# Altium schematic sheet P2_CCD_CAM_BOARD_POWER.SchDoc (part 2 of 3)
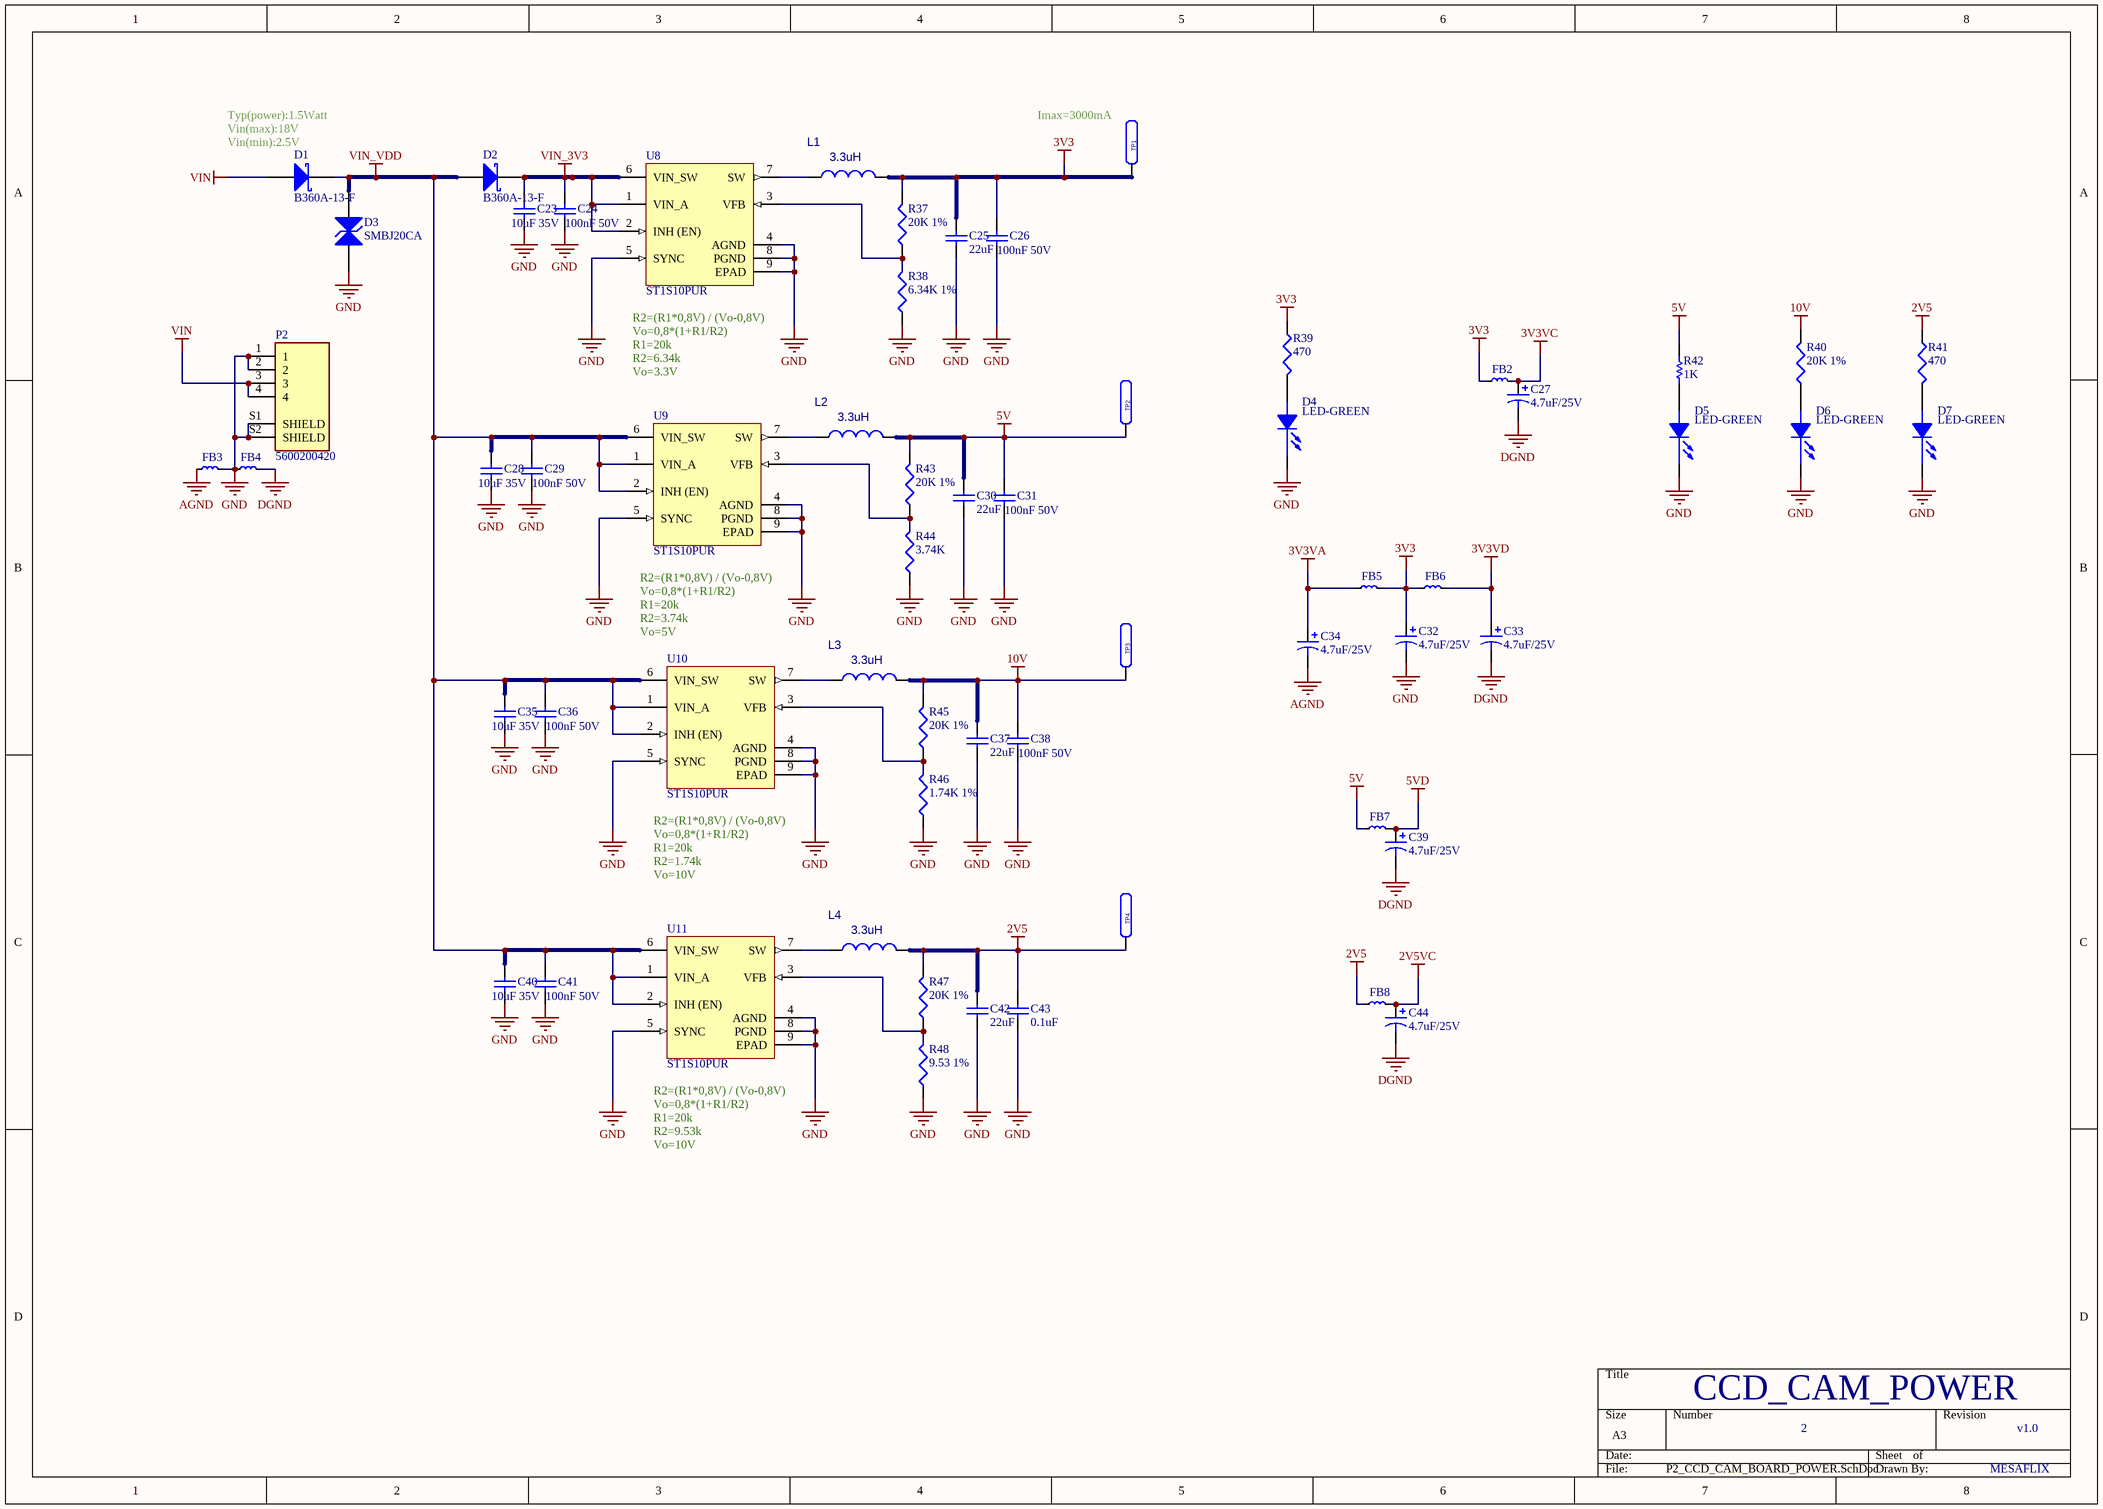
[diagram p1: P2_CCD_CAM_BOARD_POWER.SchDoc]
## Library data of the parts
C23 C28 C35 C40 = Cap: Cap Ceramic 10uF 35V X5R 20% Pad SMD 0603 85C T/R; Manufacturer: Murata; Manufacturer Part Number: GRM188R6YA106MA73D; ComponentLink1URL: http://components.arrow.com/part/dataview/0323_06977919?src-supplier=Arrow+Europe; ComponentLink1Description: http://components.arrow.com/part/dataview/0323_06977919?src-supplier=Arrow+Europe; ComponentLink2URL: http://www.farnell.com/datasheets/1955679.pdf?src-supplier=Farnell; ComponentLink2Description: http://www.farnell.com/datasheets/1955679.pdf?src-supplier=Farnell; ComponentLink3URL: http://www.mouser.com/ds/2/281/c02e-2905.pdf?src-supplier=Mouser; ComponentLink3Description: http://www.mouser.com/ds/2/281/c02e-2905.pdf?src-supplier=Mouser; ComponentLink4URL: http://search.murata.co.jp/Ceramy/image/img/A01X/G101/ENG/GRM188R60J106KE47-02.pdf?src-supplier=Digi-Key; ComponentLink4Description: http://search.murata.co.jp/Ceramy/image/img/A01X/G101/ENG/GRM188R60J106KE47-02.pdf?src-supplier=Digi-Key; ComponentLink5URL: http://www.farnell.com/datasheets/1955679.pdf?src-supplier=Newark; ComponentLink5Description: http://www.farnell.com/datasheets/1955679.pdf?src-supplier=Newark; ComponentLink6URL: http://www.farnell.com/datasheets/1955679.pdf?src-supplier=Element14; ComponentLink6Description: http://www.farnell.com/datasheets/1955679.pdf?src-supplier=Element14; ComponentLink7URL: http://psearch.en.murata.com/capacitor/product/GRM188R60J106KE47%23.pdf?src-supplier=Avnet; ComponentLink7Description: http://psearch.en.murata.com/capacitor/product/GRM188R60J106KE47%23.pdf?src-supplier=Avnet; Supplier 1: Digi-Key; Supplier Part Number 1: 490-13248-1-ND; RoHS: Yes; Category: Ceramic Capacitors; Stock 1: 69307; Pricing 1: 1=0,50000, 10=0,34600, 100=0,20760, 500=0,15570, 1000=0,13148 (USD); Mount: Surface Mount; Case/Package: 0603; Case Code (Metric): 1608; Case Code (Imperial): 0603; Min Operating Temperature: -55°C; Max Operating Temperature: 85°C; Packaging: Tape and Reel; Capacitance: 10uF; Voltage Rating: 35V; Tolerance: 20%; Voltage Rating (DC): 35V; Dielectric: X5R; Length: 0.063inch; Width: 0.031inch; Thickness: 0.039inch; ComponentLink8URL: http://search.murata.co.jp/Ceramy/image/img/A01X/G101/ENG/GRM188R6YA106MA73-01.pdf?src-supplier=Digi-Key; ComponentLink8Description: http://search.murata.co.jp/Ceramy/image/img/A01X/G101/ENG/GRM188R6YA106MA73-01.pdf?src-supplier=Digi-Key; ComponentLink9URL: http://search.murata.co.jp/Ceramy/image/img/A01X/G101/ENG/GRM188R6YA106MA73-01.pdf?src-supplier=Mouser; ComponentLink9Description: http://search.murata.co.jp/Ceramy/image/img/A01X/G101/ENG/GRM188R6YA106MA73-01.pdf?src-supplier=Mouser; ComponentLink10URL: https://www.murata.com/~/media/webrenewal/support/library/catalog/products/capacitor/mlcc/c02e.ashx?la=en-us&src-supplier=Digi-Key; ComponentLink10Description: https://www.murata.com/~/media/webrenewal/support/library/catalog/products/capacitor/mlcc/c02e.ashx?la=en-us&src-supplier=Digi-Key; ComponentLink11URL: http://search.murata.co.jp/Ceramy/image/img/A01X/G101/ENG/GRM188R6YA106MA73-01.pdf?src-supplier=Future+Electronics; ComponentLink11Description: http://search.murata.co.jp/Ceramy/image/img/A01X/G101/ENG/GRM188R6YA106MA73-01.pdf?src-supplier=Future+Electronics; ComponentLink12URL: http://search.murata.co.jp/Ceramy/image/img/A01X/G101/ENG/GRM188R6YA106MA73-01.pdf?src-supplier=TTI; ComponentLink12Description: http://search.murata.co.jp/Ceramy/image/img/A01X/G101/ENG/GRM188R6YA106MA73-01.pdf?src-supplier=TTI
C24 C26 C29 C31 C36 C38 C41 = CAP0603_100nF: CAP CER 0.1UF 50V X7R 0603; P/N: C0603C104K5RACTU; Order Code: DIGI : 399-5089-1-ND; Value: 100nF 50V
C25 C30 C37 C42 = Cap: MURATA - GRM188R60J226MEA0D - CAP, 22µF, 6.3V, 20%, X5R, 0603; ComponentLink1URL: http://components.arrow.com/part/dataview/0323_06977919?src-supplier=Arrow+Europe; ComponentLink1Description: http://components.arrow.com/part/dataview/0323_06977919?src-supplier=Arrow+Europe; ComponentLink2URL: http://www.farnell.com/datasheets/1955679.pdf?src-supplier=Farnell; ComponentLink2Description: http://www.farnell.com/datasheets/1955679.pdf?src-supplier=Farnell; ComponentLink3URL: http://www.mouser.com/ds/2/281/c02e-2905.pdf?src-supplier=Mouser; ComponentLink3Description: http://www.mouser.com/ds/2/281/c02e-2905.pdf?src-supplier=Mouser; ComponentLink4URL: http://search.murata.co.jp/Ceramy/image/img/A01X/G101/ENG/GRM188R60J106KE47-02.pdf?src-supplier=Digi-Key; ComponentLink4Description: http://search.murata.co.jp/Ceramy/image/img/A01X/G101/ENG/GRM188R60J106KE47-02.pdf?src-supplier=Digi-Key; ComponentLink5URL: http://www.farnell.com/datasheets/1955679.pdf?src-supplier=Newark; ComponentLink5Description: http://www.farnell.com/datasheets/1955679.pdf?src-supplier=Newark; ComponentLink6URL: http://www.farnell.com/datasheets/1955679.pdf?src-supplier=Element14; ComponentLink6Description: http://www.farnell.com/datasheets/1955679.pdf?src-supplier=Element14; ComponentLink7URL: http://psearch.en.murata.com/capacitor/product/GRM188R60J106KE47%23.pdf?src-supplier=Avnet; ComponentLink7Description: http://psearch.en.murata.com/capacitor/product/GRM188R60J106KE47%23.pdf?src-supplier=Avnet; Supplier 1: Digi-Key; Supplier Part Number 1: 490-7611-1-ND; Manufacturer: Murata; Manufacturer Part Number: GRM188R60J226MEA0D; RoHS: Yes; Category: Ceramic Capacitors; Stock 1: 5425522; Pricing 1: 1=0,26000, 10=0,17600, 100=0,10000, 500=0,07058, 1000=0,06176 (USD); Mount: Surface Mount; Case/Package: 0603; Weight: 0.000222oz; Case Code (Metric): 1608; Case Code (Imperial): 0603; Min Operating Temperature: -55°C; Max Operating Temperature: 85°C; Capacitance: 22uF; Tolerance: 20%; Packaging: Tape and Reel; Package Quantity: 4000; Voltage Rating: 6.3V; Dielectric: X5R; Termination: SMD/SMT; Voltage Rating (DC): 6.3V; Length: 1.6mm; Height: 0.8mm; Width: 0.8mm; Thickness: 0.039inch; Depth: 0.8mm; REACH SVHC: No SVHC; Lead Free: Lead Free; ComponentLink8URL: https://datasheet.ciiva.com/29540/partnumbering-e-01-29540441.pdf?src-supplier=Digi-Key; ComponentLink8Description: https://datasheet.ciiva.com/29540/partnumbering-e-01-29540441.pdf?src-supplier=Digi-Key; ComponentLink9URL: https://datasheet.ciiva.com/29540/partnumbering-e-01-29540442.pdf?src-supplier=Digi-Key; ComponentLink9Description: https://datasheet.ciiva.com/29540/partnumbering-e-01-29540442.pdf?src-supplier=Digi-Key; ComponentLink10URL: https://datasheet.ciiva.com/29540/partnumbering-e-01-29540443.pdf?src-supplier=Digi-Key; ComponentLink10Description: https://datasheet.ciiva.com/29540/partnumbering-e-01-29540443.pdf?src-supplier=Digi-Key
C27 C32-C34 C39 C44 = Cap Chip Pol: GRM219R61E475KA73D / Chip capacitor can be polarized or not, depending on the chip type.  Verify Capacitance and package size before placing.; Mfr Part #: GRM219R61E475KA73D
C43 = Cap: Capacitor; Manufacturer: Murata; Manufacturer Part Number: GRM155R71C104KA88D; Material: Ceramic; Capacitance: 100nF; Tolerance: 10%; Dielectric: X7R; Voltage Rating: 16V; Insulation Resistance: 10GR; Supplier 1: Digi-Key; Supplier Part Number 1: 490-3261-6-ND; Stock 1: 141162259; Pricing 1: 1 = 0,10000, 10 = 0,03300, 100 = 0,01470, 500 = 0,01046, 1000 = 0,00822, 2500 = 0,00748, 5000 = 0,00688 (USD); RoHS: Yes; Mount: Surface Mount; Case/Package: 0402; Number of Pins: 2; Case Code (Metric): 1005; Case Code (Imperial): 0402; Dielectric Material: Ceramic; Min Operating Temperature: -55°C; Max Operating Temperature: 125°C; Packaging: Tape and Reel; Voltage Rating (DC): 16V; Package Quantity: 1; Termination: SMD/SMT; Voltage: 16V; Length: 1mm; Height: 0.5mm; Width: 0.5mm; Thickness: 0.022inch; Depth: 0.5mm; Radiation Hardening: No; REACH SVHC: No SVHC; Lead Free: Lead Free; ComponentLink1URL: https://datasheet.ciiva.com/18102/getdatasheetpartid-85307-18102905.pdf?src-supplier=Verical; ComponentLink1Description: https://datasheet.ciiva.com/18102/getdatasheetpartid-85307-18102905.pdf?src-supplier=Verical; ComponentLink2URL: https://datasheet.ciiva.com/129/grm155r71c104ka88-01-129739.pdf?src-supplier=Digi-Key; ComponentLink2Description: https://datasheet.ciiva.com/129/grm155r71c104ka88-01-129739.pdf?src-supplier=Digi-Key; ComponentLink3URL: https://datasheet.ciiva.com/129/grm155r71c104ka88-01-129740.pdf?src-supplier=Digi-Key; ComponentLink3Description: https://datasheet.ciiva.com/129/grm155r71c104ka88-01-129740.pdf?src-supplier=Digi-Key; ComponentLink4URL: https://datasheet.ciiva.com/29199/454098-da-01-en-vs-kondensator-0402-29199799.pdf?src-supplier=Conrad; ComponentLink4Description: https://datasheet.ciiva.com/29199/454098-da-01-en-vs-kondensator-0402-29199799.pdf?src-supplier=Conrad; ComponentLink5URL: https://datasheet.ciiva.com/28534/4360-28534133.pdf?src-supplier=Element14; ComponentLink5Description: https://datasheet.ciiva.com/28534/4360-28534133.pdf?src-supplier=Element14; ComponentLink6URL: https://datasheet.ciiva.com/14103/grmseries-highdielectrictype-eng-14103750.pdf?src-supplier=Distrelec; ComponentLink6Description: https://datasheet.ciiva.com/14103/grmseries-highdielectrictype-eng-14103750.pdf?src-supplier=Distrelec; ComponentLink7URL: https://datasheet.ciiva.com/16199/product-16199000.pdf?src-supplier=Future+Electronics; ComponentLink7Description: https://datasheet.ciiva.com/16199/product-16199000.pdf?src-supplier=Future+Electronics; ComponentLink8URL: https://datasheet.ciiva.com/14116/grmseries-highdielectrictype-eng-14116878.pdf?src-supplier=Distrelec; ComponentLink8Description: https://datasheet.ciiva.com/14116/grmseries-highdielectrictype-eng-14116878.pdf?src-supplier=Distrelec; ComponentLink9URL: https://datasheet.ciiva.com/7937/4360-7937615.pdf?src-supplier=Element14; ComponentLink9Description: https://datasheet.ciiva.com/7937/4360-7937615.pdf?src-supplier=Element14; ComponentLink10URL: https://datasheet.ciiva.com/28534/4360-28534127.pdf?src-supplier=Element14; ComponentLink10Description: https://datasheet.ciiva.com/28534/4360-28534127.pdf?src-supplier=Element14
D1 D2 = CMP-2000-05898-1: Schottky Barrier Rectifier, 3 A, -55 to 150 degC, 2-Pin Molded, RoHS, Tape and Reel; Manufacturer: Diodes; Forward Current: 3A; Max Repetitive Reverse Voltage (Vrrm): 60V; Element Configuration: Single; Forward Voltage: 700mV; Peak Reverse Current: 500uA; Max Forward Surge Current (Ifsm): 80A; Polarity: Standard; Capacitance: 250pF; Supplier 1: Digi-Key; Supplier Part Number 1: B360A-FDICT-ND; Manufacturer Part Number: B360A-13-F; RoHS: Yes; Category: Schottky Diodes; Stock 1: 508300; Pricing 1: 1=0,38000, 10=0,30800, 100=0,17690, 500=0,16380, 1000=0,11138 (USD); Mount: Surface Mount; Case/Package: SMA; Number of Pins: 2; Weight: 0.002258oz; Contact Plating: Tin,Matte; Min Operating Temperature: -55°C; Max Operating Temperature: 150°C; Packaging: Tape and Reel; Peak Non-Repetitive Surge Current: 80A; Package Quantity: 5000; Average Rectified Current: 3A; Termination: SMD/SMT; Voltage Rating (DC): 60V; Current Rating: 3A; Output Current: 3A; Max Reverse Voltage (DC): 60V; Length: 4.6mm; Height: 2.3mm; Width: 2.92mm; Radiation Hardening: No; REACH SVHC: No SVHC; Lead Free: Lead Free; ComponentLink1URL: https://datasheet.ciiva.com/914/ds30891-914080.pdf?src-supplier=Digi-Key; ComponentLink1Description: https://datasheet.ciiva.com/914/ds30891-914080.pdf?src-supplier=Digi-Key; ComponentLink2URL: https://datasheet.ciiva.com/4244/861ds30891-4244631.pdf?src-supplier=Arrow; ComponentLink2Description: https://datasheet.ciiva.com/4244/861ds30891-4244631.pdf?src-supplier=Arrow; ComponentLink3URL: https://datasheet.ciiva.com/34302/1538902-34302361.pdf?src-supplier=Jameco; ComponentLink3Description: https://datasheet.ciiva.com/34302/1538902-34302361.pdf?src-supplier=Jameco; ComponentLink4URL: https://datasheet.ciiva.com/26788/b360a-13-f-26788524.pdf?src-supplier=IIIC; ComponentLink4Description: https://datasheet.ciiva.com/26788/b360a-13-f-26788524.pdf?src-supplier=IIIC; ComponentLink5URL: https://datasheet.ciiva.com/914/ds30891-914081.pdf?src-supplier=Digi-Key; ComponentLink5Description: https://datasheet.ciiva.com/914/ds30891-914081.pdf?src-supplier=Digi-Key; ComponentLink6URL: https://datasheet.ciiva.com/25919/ds30891-25919703.pdf?src-supplier=Avnet+Europe; ComponentLink6Description: https://datasheet.ciiva.com/25919/ds30891-25919703.pdf?src-supplier=Avnet+Europe; ComponentLink7URL: https://datasheet.ciiva.com/22695/1911813-22695787.pdf?src-supplier=Element14; ComponentLink7Description: https://datasheet.ciiva.com/22695/1911813-22695787.pdf?src-supplier=Element14; ComponentLink8URL: https://datasheet.ciiva.com/914/ds30891-914082.pdf?src-supplier=Digi-Key; ComponentLink8Description: https://datasheet.ciiva.com/914/ds30891-914082.pdf?src-supplier=Digi-Key; ComponentLink9URL: https://datasheet.ciiva.com/1177/ds30891-1177482.pdf?src-supplier=Element14; ComponentLink9Description: https://datasheet.ciiva.com/1177/ds30891-1177482.pdf?src-supplier=Element14; ComponentLink10URL: https://datasheet.ciiva.com/16199/ds13005-16199422.pdf?src-supplier=Future+Electronics; ComponentLink10Description: https://datasheet.ciiva.com/16199/ds13005-16199422.pdf?src-supplier=Future+Electronics
D3 = CMP-2000-07097-1: Manufacturer: Bourns; Clamping Voltage: 32.4V; Peak Pulse Power: 600W; Reverse Standoff Voltage: 20V; Peak Pulse Current: 18.5A; Polarity: Bidirectional; Test Current: 1mA; Breakdown Voltage: 25.5V; Max Surge Current: 100A; Min Breakdown Voltage: 22.2V; Number of Elements: 1; Operating Supply Voltage: 3.5V; Leakage Current: 5uA; Power Line Protection: No; Element Configuration: Single; ComponentLink1URL: https://datasheet.ciiva.com/15143/getdatasheetpartid-185159-15143883.pdf?src-supplier=Verical; ComponentLink1Description: https://datasheet.ciiva.com/15143/getdatasheetpartid-185159-15143883.pdf?src-supplier=Verical; ComponentLink2URL: https://datasheet.ciiva.com/331/littelfuse-tvs-diode-smbj-datasheet-pdf-331700.pdf?src-supplier=Digi-Key; ComponentLink2Description: https://datasheet.ciiva.com/331/littelfuse-tvs-diode-smbj-datasheet-pdf-331700.pdf?src-supplier=Digi-Key; ComponentLink3URL: https://datasheet.ciiva.com/331/littelfuse-tvs-diode-smbj-datasheet-pdf-331701.pdf?src-supplier=Digi-Key; ComponentLink3Description: https://datasheet.ciiva.com/331/littelfuse-tvs-diode-smbj-datasheet-pdf-331701.pdf?src-supplier=Digi-Key; ComponentLink4URL: https://datasheet.ciiva.com/16291/littelfuse-tvs-diode-smbj-16291749.pdf?src-supplier=Future+Electronics; ComponentLink4Description: https://datasheet.ciiva.com/16291/littelfuse-tvs-diode-smbj-16291749.pdf?src-supplier=Future+Electronics; ComponentLink5URL: https://datasheet.ciiva.com/331/littelfuse-tvs-diode-smbj-datasheet-pdf-331702.pdf?src-supplier=Digi-Key; ComponentLink5Description: https://datasheet.ciiva.com/331/littelfuse-tvs-diode-smbj-datasheet-pdf-331702.pdf?src-supplier=Digi-Key; ComponentLink6URL: https://datasheet.ciiva.com/8062/littelfuse-tvs-diode-smbj-8062331.pdf?src-supplier=Element14; ComponentLink6Description: https://datasheet.ciiva.com/8062/littelfuse-tvs-diode-smbj-8062331.pdf?src-supplier=Element14; ComponentLink7URL: https://datasheet.ciiva.com/4509/littelfuse-tvs-diode-smbj-48653-4509661.pdf?src-supplier=Mouser; ComponentLink7Description: https://datasheet.ciiva.com/4509/littelfuse-tvs-diode-smbj-48653-4509661.pdf?src-supplier=Mouser; ComponentLink8URL: https://datasheet.ciiva.com/14162/smbj-eng-ds-14162031.pdf?src-supplier=Distrelec; ComponentLink8Description: https://datasheet.ciiva.com/14162/smbj-eng-ds-14162031.pdf?src-supplier=Distrelec; Supplier 1: Digi-Key; Supplier Part Number 1: SMBJ20CABCT-ND; Manufacturer Part Number: SMBJ20CA; RoHS: Yes; Category: TVS Diodes; Stock 1: 8734; Pricing 1: 1=0,46000, 10=0,34800, 25=0,31360, 100=0,16530, 250=0,16360, 500=0,14650, 1000=0,11400 (USD); Mount: Surface Mount; Case/Package: SMB; Number of Pins: 2; Min Operating Temperature: -55°C; Max Operating Temperature: 150°C; Packaging: Tape and Reel; Package Quantity: 1; Reverse Breakdown Voltage: 22.2V; Number of Channels: 1; Direction: Bidirectional; Composition: Zener; Max Reverse Leakage Current: 5uA; Termination: SMD/SMT; Number of Bidirectional Channels: 1; Max Breakdown Voltage: 25.5V; Max Power Dissipation: 600W; Radiation Hardening: No; REACH SVHC: No SVHC; ComponentLink9URL: https://datasheet.ciiva.com/3022/smbj-3022486.pdf?src-supplier=Avnet; ComponentLink9Description: https://datasheet.ciiva.com/3022/smbj-3022486.pdf?src-supplier=Avnet; ComponentLink10URL: https://datasheet.ciiva.com/3022/smbj-3022487.pdf?src-supplier=Avnet; ComponentLink10Description: https://datasheet.ciiva.com/3022/smbj-3022487.pdf?src-supplier=Avnet; ComponentLink11URL: https://datasheet.ciiva.com/17413/smbj-17413419.pdf?src-supplier=Avnet+Europe; ComponentLink11Description: https://datasheet.ciiva.com/17413/smbj-17413419.pdf?src-supplier=Avnet+Europe; ComponentLink12URL: https://datasheet.ciiva.com/334/smbj-334796.pdf?src-supplier=Digi-Key; ComponentLink12Description: https://datasheet.ciiva.com/334/smbj-334796.pdf?src-supplier=Digi-Key; ComponentLink13URL: https://datasheet.ciiva.com/334/smbj-334798.pdf?src-supplier=Digi-Key; ComponentLink13Description: https://datasheet.ciiva.com/334/smbj-334798.pdf?src-supplier=Digi-Key; ComponentLink14URL: https://datasheet.ciiva.com/334/smbj-334797.pdf?src-supplier=Digi-Key; ComponentLink14Description: https://datasheet.ciiva.com/334/smbj-334797.pdf?src-supplier=Digi-Key
D4-D7 = LED: ROHM         SML-D12P8WT86             LED, EXCELED, Green, SMD, 20 mA, 2.2 V, 560 nm; Lens Color: White; Lens Style: Rectangular,Diffused,Colorless; Dominant Wavelength: 560nm; Forward Voltage: 2.2V; Luminous Intensity: 6.3mcd; Test Current: 20mA; Number of LEDs: 1; Viewing Angle: 160°; Lens Transparency: Diffused; ComponentLink1URL: https://datasheet.ciiva.com/12400/ltst-s270gkt-201857-12400883.pdf?src-supplier=Mouser; ComponentLink1Description: https://datasheet.ciiva.com/12400/ltst-s270gkt-201857-12400883.pdf?src-supplier=Mouser; ComponentLink2URL: https://datasheet.ciiva.com/11773/0900766b80dc0b86-11773515.pdf?src-supplier=RSComponents; ComponentLink2Description: https://datasheet.ciiva.com/11773/0900766b80dc0b86-11773515.pdf?src-supplier=RSComponents; ComponentLink3URL: https://datasheet.ciiva.com/2110/ltst-s270gkt-2110018.pdf?src-supplier=Digi-Key; ComponentLink3Description: https://datasheet.ciiva.com/2110/ltst-s270gkt-2110018.pdf?src-supplier=Digi-Key; ComponentLink4URL: https://datasheet.ciiva.com/2110/ltst-s270gkt-2110020.pdf?src-supplier=Digi-Key; ComponentLink4Description: https://datasheet.ciiva.com/2110/ltst-s270gkt-2110020.pdf?src-supplier=Digi-Key; ComponentLink5URL: https://datasheet.ciiva.com/2110/ltst-s270gkt-2110019.pdf?src-supplier=Digi-Key; ComponentLink5Description: https://datasheet.ciiva.com/2110/ltst-s270gkt-2110019.pdf?src-supplier=Digi-Key; ComponentLink6URL: https://datasheet.ciiva.com/2110/sml-d1-2110417.pdf?src-supplier=Digi-Key; ComponentLink6Description: https://datasheet.ciiva.com/2110/sml-d1-2110417.pdf?src-supplier=Digi-Key; ComponentLink7URL: https://datasheet.ciiva.com/16488/rohm20sml-d12p8wt86-16488100.pdf?src-supplier=Future+Electronics; ComponentLink7Description: https://datasheet.ciiva.com/16488/rohm20sml-d12p8wt86-16488100.pdf?src-supplier=Future+Electronics; ComponentLink8URL: https://datasheet.ciiva.com/2110/sml-d1-2110418.pdf?src-supplier=Digi-Key; ComponentLink8Description: https://datasheet.ciiva.com/2110/sml-d1-2110418.pdf?src-supplier=Digi-Key; ComponentLink9URL: https://datasheet.ciiva.com/2110/sml-d1-2110419.pdf?src-supplier=Digi-Key; ComponentLink9Description: https://datasheet.ciiva.com/2110/sml-d1-2110419.pdf?src-supplier=Digi-Key; ComponentLink10URL: https://datasheet.ciiva.com/3161/sml-d1-3161420.pdf?src-supplier=Avnet; ComponentLink10Description: https://datasheet.ciiva.com/3161/sml-d1-3161420.pdf?src-supplier=Avnet; Supplier 1: Digi-Key; Supplier Part Number 1: 511-1579-1-ND; Manufacturer: Rohm; Manufacturer Part Number: SML-D12P8WT86; RoHS: Yes; Category: LEDs; Stock 1: 31644; Pricing 1: 1=0,33000, 10=0,23900, 100=0,11340, 500=0,07560, 1000=0,05922 (USD); Mount: Surface Mount; Case/Package: 0603; Number of Pins: 2; Color: Green; Case Code (Metric): 1608; Case Code (Imperial): 0603; Min Operating Temperature: -40°C; Max Operating Temperature: 85°C; Packaging: Tape and Reel; Package Quantity: 1; Illumination Color: Green; Forward Current: 20mA; Wavelength: 560nm; Length: 1.6mm; Height: 0.65mm; Width: 0.8mm; Radiation Hardening: No; REACH SVHC: Unknown; Lead Free: Lead Free
FB2-FB8 = FB: Mfr Part #: NFZ2MSD600SN10L
L1-L4 = INDUCTOR: Manufacturer: Vishay Dale; Manufacturer Part Number: IFSC1515AHER3R3M01; Tolerance: 20%; Shielding: Shielded; Current Rating: 2.7A; Saturation Current: 2.4A; DC Resistance (DCR): 56mR; Test Frequency: 100kHz; Supplier 1: Digi-Key; Supplier Part Number 1: 541-2549-1-ND; Stock 1: 20851; Pricing 1: 1 = 0,64000, 10 = 0,55900, 100 = 0,39960, 500 = 0,33568, 1000 = 0,27175 (USD); RoHS: Yes; Mount: Surface Mount; Case/Package: 1515; Number of Pins: 2; Weight: 0.001693oz; Min Operating Temperature: -55°C; Max Operating Temperature: 125°C; Packaging: Tape and Reel; Inductance Tolerance: 20%; Package Quantity: 2000; Inductance: 3.3uH; Max DC Current: 2.4A; Termination: SMD/SMT; RMS Current (Irms): 2.7A; Military Standard: Not; Length: 0.15inch; Height: 0.071inch; Width: 0.15inch; Height - Seated (Max): 0.075inch; Depth: 4mm; REACH SVHC: Unknown; Lead Free: Lead Free; ComponentLink1URL: https://datasheet.ciiva.com/8494/sc15ah01-8494965.pdf?src-supplier=Avnet; ComponentLink1Description: https://datasheet.ciiva.com/8494/sc15ah01-8494965.pdf?src-supplier=Avnet; ComponentLink2URL: https://datasheet.ciiva.com/8017/sc15ah01-8017544.pdf?src-supplier=Element14; ComponentLink2Description: https://datasheet.ciiva.com/8017/sc15ah01-8017544.pdf?src-supplier=Element14; ComponentLink3URL: https://datasheet.ciiva.com/22726/1730404-22726059.pdf?src-supplier=Element14; ComponentLink3Description: https://datasheet.ciiva.com/22726/1730404-22726059.pdf?src-supplier=Element14; ComponentLink4URL: https://datasheet.ciiva.com/16441/sc15ah01-16441598.pdf?src-supplier=Future+Electronics; ComponentLink4Description: https://datasheet.ciiva.com/16441/sc15ah01-16441598.pdf?src-supplier=Future+Electronics; ComponentLink5URL: https://datasheet.ciiva.com/6694/sc15ah01-6694703.pdf?src-supplier=Digi-Key; ComponentLink5Description: https://datasheet.ciiva.com/6694/sc15ah01-6694703.pdf?src-supplier=Digi-Key
P2 = 5600200420: Connector Header Surface Mount 4 position 0.079 (2.00mm); MF: Molex; Price: None; Availability: Unavailable; MP: 5600200420; Package: None; SnapEDA_Link: https://www.snapeda.com/parts/5600200420/Molex/view-part/47265/?ref=snap; Value: *
R37 R40 R43 R45 R47 = Res3: RES 20K OHM 1% 1/16W 0402; Manufacturer: Vishay; Manufacturer Part Number: CRCW040220K0FKEDC; Power Rating: 62.5mW; Resistance: 20kR; Temperature Coefficient: 100ppm/°C; ComponentLink1URL: https://datasheet.ciiva.com/11819/0900766b80c66297-11819477.pdf?src-supplier=RSComponents; ComponentLink1Description: https://datasheet.ciiva.com/11819/0900766b80c66297-11819477.pdf?src-supplier=RSComponents; ComponentLink2URL: https://datasheet.ciiva.com/12666/pyu-rc0402-51-rohs-l-6-r-12666741.pdf?src-supplier=Mouser; ComponentLink2Description: https://datasheet.ciiva.com/12666/pyu-rc0402-51-rohs-l-6-r-12666741.pdf?src-supplier=Mouser; ComponentLink3URL: https://datasheet.ciiva.com/17063/pyu-rc0402-51-rohs-l-6-r-17063193.pdf?src-supplier=Future+Electronics; ComponentLink3Description: https://datasheet.ciiva.com/17063/pyu-rc0402-51-rohs-l-6-r-17063193.pdf?src-supplier=Future+Electronics; ComponentLink4URL: https://datasheet.ciiva.com/22747/1018594-22747513.pdf?src-supplier=Element14; ComponentLink4Description: https://datasheet.ciiva.com/22747/1018594-22747513.pdf?src-supplier=Element14; ComponentLink5URL: https://datasheet.ciiva.com/7849/1018594-7849869.pdf?src-supplier=Element14; ComponentLink5Description: https://datasheet.ciiva.com/7849/1018594-7849869.pdf?src-supplier=Element14; ComponentLink6URL: https://datasheet.ciiva.com/7983/1018594-7983502.pdf?src-supplier=Element14; ComponentLink6Description: https://datasheet.ciiva.com/7983/1018594-7983502.pdf?src-supplier=Element14; ComponentLink7URL: https://datasheet.ciiva.com/7849/1018594-7849871.pdf?src-supplier=Element14; ComponentLink7Description: https://datasheet.ciiva.com/7849/1018594-7849871.pdf?src-supplier=Element14; ComponentLink8URL: https://datasheet.ciiva.com/2553/pyu-r-int-thick-7-2553200.pdf?src-supplier=Digi-Key; ComponentLink8Description: https://datasheet.ciiva.com/2553/pyu-r-int-thick-7-2553200.pdf?src-supplier=Digi-Key; ComponentLink9URL: https://datasheet.ciiva.com/7983/1018594-7983501.pdf?src-supplier=Element14; ComponentLink9Description: https://datasheet.ciiva.com/7983/1018594-7983501.pdf?src-supplier=Element14; ComponentLink10URL: https://datasheet.ciiva.com/2553/pyu-r-int-thick-7-2553201.pdf?src-supplier=Digi-Key; ComponentLink10Description: https://datasheet.ciiva.com/2553/pyu-r-int-thick-7-2553201.pdf?src-supplier=Digi-Key; ComponentLink11URL: https://datasheet.ciiva.com/2553/pyu-r-int-thick-7-2553202.pdf?src-supplier=Digi-Key; ComponentLink11Description: https://datasheet.ciiva.com/2553/pyu-r-int-thick-7-2553202.pdf?src-supplier=Digi-Key; ComponentLink12URL: https://datasheet.ciiva.com/15189/getdatasheetpartid-251817-15189388.pdf?src-supplier=Verical; ComponentLink12Description: https://datasheet.ciiva.com/15189/getdatasheetpartid-251817-15189388.pdf?src-supplier=Verical; ComponentLink13URL: https://datasheet.ciiva.com/11808/0900766b80c66297-11808454.pdf?src-supplier=RSComponents; ComponentLink13Description: https://datasheet.ciiva.com/11808/0900766b80c66297-11808454.pdf?src-supplier=RSComponents; ComponentLink14URL: https://datasheet.ciiva.com/2453/pyu-r-int-thick-7-2453494.pdf?src-supplier=Digi-Key; ComponentLink14Description: https://datasheet.ciiva.com/2453/pyu-r-int-thick-7-2453494.pdf?src-supplier=Digi-Key; ComponentLink15URL: https://datasheet.ciiva.com/2453/pyu-r-int-thick-7-2453495.pdf?src-supplier=Digi-Key; ComponentLink15Description: https://datasheet.ciiva.com/2453/pyu-r-int-thick-7-2453495.pdf?src-supplier=Digi-Key; ComponentLink16URL: https://datasheet.ciiva.com/7983/1018594-7983511.pdf?src-supplier=Element14; ComponentLink16Description: https://datasheet.ciiva.com/7983/1018594-7983511.pdf?src-supplier=Element14; ComponentLink17URL: https://datasheet.ciiva.com/12558/pyu-rc0402-51-rohs-l-6-r-8721-12558796.pdf?src-supplier=Mouser; ComponentLink17Description: https://datasheet.ciiva.com/12558/pyu-rc0402-51-rohs-l-6-r-8721-12558796.pdf?src-supplier=Mouser; ComponentLink18URL: https://datasheet.ciiva.com/2453/pyu-r-int-thick-7-2453493.pdf?src-supplier=Digi-Key; ComponentLink18Description: https://datasheet.ciiva.com/2453/pyu-r-int-thick-7-2453493.pdf?src-supplier=Digi-Key; ComponentLink19URL: https://datasheet.ciiva.com/46394/1018594-46394974.pdf?src-supplier=Element14; ComponentLink19Description: https://datasheet.ciiva.com/46394/1018594-46394974.pdf?src-supplier=Element14; Supplier 1: Digi-Key; Supplier Part Number 1: 541-3969-1-ND; RoHS: Yes; Category: Resistors; Stock 1: 532226; Pricing 1: 1=0,10000, 10=0,03200, 100=0,01300, 1000=0,00583, 2500=0,00506, 5000=0,00418 (USD); Mount: Surface Mount; Case/Package: SMD/SMT; Contact Plating: Tin; Min Operating Temperature: -55°C; Max Operating Temperature: 155°C; Tolerance: 1%; Composition: Thick Film; Termination: Wraparound; Length: 1mm; Lead Free: Lead Free; ComponentLink20URL: http://www.vishay.com/docs/28773/crcwce3.pdf?src-supplier=Digi-Key; ComponentLink20Description: http://www.vishay.com/docs/28773/crcwce3.pdf?src-supplier=Digi-Key
R38 = Res3: RES SMD 6.34K OHM 1% 1/16W 0402; ComponentLink1URL: https://datasheet.ciiva.com/11819/0900766b80c66297-11819477.pdf?src-supplier=RSComponents; ComponentLink1Description: https://datasheet.ciiva.com/11819/0900766b80c66297-11819477.pdf?src-supplier=RSComponents; ComponentLink2URL: https://datasheet.ciiva.com/12666/pyu-rc0402-51-rohs-l-6-r-12666741.pdf?src-supplier=Mouser; ComponentLink2Description: https://datasheet.ciiva.com/12666/pyu-rc0402-51-rohs-l-6-r-12666741.pdf?src-supplier=Mouser; ComponentLink3URL: https://datasheet.ciiva.com/17063/pyu-rc0402-51-rohs-l-6-r-17063193.pdf?src-supplier=Future+Electronics; ComponentLink3Description: https://datasheet.ciiva.com/17063/pyu-rc0402-51-rohs-l-6-r-17063193.pdf?src-supplier=Future+Electronics; ComponentLink4URL: https://datasheet.ciiva.com/22747/1018594-22747513.pdf?src-supplier=Element14; ComponentLink4Description: https://datasheet.ciiva.com/22747/1018594-22747513.pdf?src-supplier=Element14; ComponentLink5URL: https://datasheet.ciiva.com/7849/1018594-7849869.pdf?src-supplier=Element14; ComponentLink5Description: https://datasheet.ciiva.com/7849/1018594-7849869.pdf?src-supplier=Element14; ComponentLink6URL: https://datasheet.ciiva.com/7983/1018594-7983502.pdf?src-supplier=Element14; ComponentLink6Description: https://datasheet.ciiva.com/7983/1018594-7983502.pdf?src-supplier=Element14; ComponentLink7URL: https://datasheet.ciiva.com/7849/1018594-7849871.pdf?src-supplier=Element14; ComponentLink7Description: https://datasheet.ciiva.com/7849/1018594-7849871.pdf?src-supplier=Element14; ComponentLink8URL: https://datasheet.ciiva.com/2553/pyu-r-int-thick-7-2553200.pdf?src-supplier=Digi-Key; ComponentLink8Description: https://datasheet.ciiva.com/2553/pyu-r-int-thick-7-2553200.pdf?src-supplier=Digi-Key; ComponentLink9URL: https://datasheet.ciiva.com/7983/1018594-7983501.pdf?src-supplier=Element14; ComponentLink9Description: https://datasheet.ciiva.com/7983/1018594-7983501.pdf?src-supplier=Element14; ComponentLink10URL: https://datasheet.ciiva.com/2553/pyu-r-int-thick-7-2553201.pdf?src-supplier=Digi-Key; ComponentLink10Description: https://datasheet.ciiva.com/2553/pyu-r-int-thick-7-2553201.pdf?src-supplier=Digi-Key; ComponentLink11URL: https://datasheet.ciiva.com/2553/pyu-r-int-thick-7-2553202.pdf?src-supplier=Digi-Key; ComponentLink11Description: https://datasheet.ciiva.com/2553/pyu-r-int-thick-7-2553202.pdf?src-supplier=Digi-Key; ComponentLink12URL: https://datasheet.ciiva.com/15189/getdatasheetpartid-251817-15189388.pdf?src-supplier=Verical; ComponentLink12Description: https://datasheet.ciiva.com/15189/getdatasheetpartid-251817-15189388.pdf?src-supplier=Verical; ComponentLink13URL: https://datasheet.ciiva.com/11808/0900766b80c66297-11808454.pdf?src-supplier=RSComponents; ComponentLink13Description: https://datasheet.ciiva.com/11808/0900766b80c66297-11808454.pdf?src-supplier=RSComponents; ComponentLink14URL: https://datasheet.ciiva.com/2453/pyu-r-int-thick-7-2453494.pdf?src-supplier=Digi-Key; ComponentLink14Description: https://datasheet.ciiva.com/2453/pyu-r-int-thick-7-2453494.pdf?src-supplier=Digi-Key; ComponentLink15URL: https://datasheet.ciiva.com/2453/pyu-r-int-thick-7-2453495.pdf?src-supplier=Digi-Key; ComponentLink15Description: https://datasheet.ciiva.com/2453/pyu-r-int-thick-7-2453495.pdf?src-supplier=Digi-Key; ComponentLink16URL: https://datasheet.ciiva.com/7983/1018594-7983511.pdf?src-supplier=Element14; ComponentLink16Description: https://datasheet.ciiva.com/7983/1018594-7983511.pdf?src-supplier=Element14; ComponentLink17URL: https://datasheet.ciiva.com/12558/pyu-rc0402-51-rohs-l-6-r-8721-12558796.pdf?src-supplier=Mouser; ComponentLink17Description: https://datasheet.ciiva.com/12558/pyu-rc0402-51-rohs-l-6-r-8721-12558796.pdf?src-supplier=Mouser; ComponentLink18URL: https://datasheet.ciiva.com/2453/pyu-r-int-thick-7-2453493.pdf?src-supplier=Digi-Key; ComponentLink18Description: https://datasheet.ciiva.com/2453/pyu-r-int-thick-7-2453493.pdf?src-supplier=Digi-Key; ComponentLink19URL: https://datasheet.ciiva.com/46394/1018594-46394974.pdf?src-supplier=Element14; ComponentLink19Description: https://datasheet.ciiva.com/46394/1018594-46394974.pdf?src-supplier=Element14; ComponentLink20URL: https://datasheet.ciiva.com/15189/getdatasheetpartid-323692-15189807.pdf?src-supplier=Verical; ComponentLink20Description: https://datasheet.ciiva.com/15189/getdatasheetpartid-323692-15189807.pdf?src-supplier=Verical; ComponentLink21URL: https://datasheet.ciiva.com/2519/pyu-r-int-thick-7-2519204.pdf?src-supplier=Digi-Key; ComponentLink21Description: https://datasheet.ciiva.com/2519/pyu-r-int-thick-7-2519204.pdf?src-supplier=Digi-Key; ComponentLink22URL: https://datasheet.ciiva.com/2519/pyu-r-int-thick-7-2519205.pdf?src-supplier=Digi-Key; ComponentLink22Description: https://datasheet.ciiva.com/2519/pyu-r-int-thick-7-2519205.pdf?src-supplier=Digi-Key; ComponentLink23URL: https://datasheet.ciiva.com/2519/pyu-r-int-thick-7-2519206.pdf?src-supplier=Digi-Key; ComponentLink23Description: https://datasheet.ciiva.com/2519/pyu-r-int-thick-7-2519206.pdf?src-supplier=Digi-Key; ComponentLink24URL: https://datasheet.ciiva.com/5556/rk73h-5556598.pdf?src-supplier=Mouser; ComponentLink24Description: https://datasheet.ciiva.com/5556/rk73h-5556598.pdf?src-supplier=Mouser; ComponentLink25URL: https://datasheet.ciiva.com/16868/pyu-rc0402-51-rohs-l-6-16868119.pdf?src-supplier=Avnet+Europe; ComponentLink25Description: https://datasheet.ciiva.com/16868/pyu-rc0402-51-rohs-l-6-16868119.pdf?src-supplier=Avnet+Europe; ComponentLink26URL: https://datasheet.ciiva.com/8892/pyu-rc0402-51-rohs-l-6-8892634.pdf?src-supplier=Avnet; ComponentLink26Description: https://datasheet.ciiva.com/8892/pyu-rc0402-51-rohs-l-6-8892634.pdf?src-supplier=Avnet; ComponentLink27URL: https://datasheet.ciiva.com/28409/pyu-rc0402-51-rohs-l-6-28409292.pdf?src-supplier=Avnet+Europe; ComponentLink27Description: https://datasheet.ciiva.com/28409/pyu-rc0402-51-rohs-l-6-28409292.pdf?src-supplier=Avnet+Europe; ComponentLink28URL: https://datasheet.ciiva.com/2453/pyu-r-int-thick-7-2453629.pdf?src-supplier=Digi-Key; ComponentLink28Description: https://datasheet.ciiva.com/2453/pyu-r-int-thick-7-2453629.pdf?src-supplier=Digi-Key; ComponentLink29URL: https://datasheet.ciiva.com/2453/pyu-r-int-thick-7-2453630.pdf?src-supplier=Digi-Key; ComponentLink29Description: https://datasheet.ciiva.com/2453/pyu-r-int-thick-7-2453630.pdf?src-supplier=Digi-Key
R39 R41 = Res3: RES SMD 470 OHM 5% 1/16W 0402; Manufacturer: Yageo; Manufacturer Part Number: RC0402JR-07470RL; Resistance: 470R; Power Rating: 62.5mW; Voltage Rating: 50V; Temperature Coefficient: 100ppm/°C; Max Power Dissipation: 63mW; ComponentLink1URL: https://datasheet.ciiva.com/11819/0900766b80c66297-11819477.pdf?src-supplier=RSComponents; ComponentLink1Description: https://datasheet.ciiva.com/11819/0900766b80c66297-11819477.pdf?src-supplier=RSComponents; ComponentLink2URL: https://datasheet.ciiva.com/12666/pyu-rc0402-51-rohs-l-6-r-12666741.pdf?src-supplier=Mouser; ComponentLink2Description: https://datasheet.ciiva.com/12666/pyu-rc0402-51-rohs-l-6-r-12666741.pdf?src-supplier=Mouser; ComponentLink3URL: https://datasheet.ciiva.com/17063/pyu-rc0402-51-rohs-l-6-r-17063193.pdf?src-supplier=Future+Electronics; ComponentLink3Description: https://datasheet.ciiva.com/17063/pyu-rc0402-51-rohs-l-6-r-17063193.pdf?src-supplier=Future+Electronics; ComponentLink4URL: https://datasheet.ciiva.com/22747/1018594-22747513.pdf?src-supplier=Element14; ComponentLink4Description: https://datasheet.ciiva.com/22747/1018594-22747513.pdf?src-supplier=Element14; ComponentLink5URL: https://datasheet.ciiva.com/7849/1018594-7849869.pdf?src-supplier=Element14; ComponentLink5Description: https://datasheet.ciiva.com/7849/1018594-7849869.pdf?src-supplier=Element14; ComponentLink6URL: https://datasheet.ciiva.com/7983/1018594-7983502.pdf?src-supplier=Element14; ComponentLink6Description: https://datasheet.ciiva.com/7983/1018594-7983502.pdf?src-supplier=Element14; ComponentLink7URL: https://datasheet.ciiva.com/7849/1018594-7849871.pdf?src-supplier=Element14; ComponentLink7Description: https://datasheet.ciiva.com/7849/1018594-7849871.pdf?src-supplier=Element14; ComponentLink8URL: https://datasheet.ciiva.com/11808/0900766b80c66297-11808195.pdf?src-supplier=RSComponents; ComponentLink8Description: https://datasheet.ciiva.com/11808/0900766b80c66297-11808195.pdf?src-supplier=RSComponents; ComponentLink9URL: https://datasheet.ciiva.com/2452/pyu-rc0402-51-rohs-l-6-2452608.pdf?src-supplier=Digi-Key; ComponentLink9Description: https://datasheet.ciiva.com/2452/pyu-rc0402-51-rohs-l-6-2452608.pdf?src-supplier=Digi-Key; ComponentLink10URL: https://datasheet.ciiva.com/2452/pyu-r-int-thick-7-2452609.pdf?src-supplier=Digi-Key; ComponentLink10Description: https://datasheet.ciiva.com/2452/pyu-r-int-thick-7-2452609.pdf?src-supplier=Digi-Key; ComponentLink11URL: https://datasheet.ciiva.com/2452/pyu-r-int-thick-7-2452610.pdf?src-supplier=Digi-Key; ComponentLink11Description: https://datasheet.ciiva.com/2452/pyu-r-int-thick-7-2452610.pdf?src-supplier=Digi-Key; ComponentLink12URL: https://datasheet.ciiva.com/28386/pyu-rc0402-51-rohs-l-6-28386633.pdf?src-supplier=Avnet+Europe; ComponentLink12Description: https://datasheet.ciiva.com/28386/pyu-rc0402-51-rohs-l-6-28386633.pdf?src-supplier=Avnet+Europe; ComponentLink13URL: https://datasheet.ciiva.com/22747/1018594-22747515.pdf?src-supplier=Element14; ComponentLink13Description: https://datasheet.ciiva.com/22747/1018594-22747515.pdf?src-supplier=Element14; ComponentLink14URL: https://datasheet.ciiva.com/7983/1018594-7983535.pdf?src-supplier=Element14; ComponentLink14Description: https://datasheet.ciiva.com/7983/1018594-7983535.pdf?src-supplier=Element14; ComponentLink15URL: https://datasheet.ciiva.com/8896/pyu-rc0402-51-rohs-l-6-8896201.pdf?src-supplier=Avnet; ComponentLink15Description: https://datasheet.ciiva.com/8896/pyu-rc0402-51-rohs-l-6-8896201.pdf?src-supplier=Avnet; ComponentLink16URL: https://datasheet.ciiva.com/15189/getdatasheetpartid-326379-15189533.pdf?src-supplier=Verical; ComponentLink16Description: https://datasheet.ciiva.com/15189/getdatasheetpartid-326379-15189533.pdf?src-supplier=Verical; ComponentLink17URL: https://datasheet.ciiva.com/2518/pyu-r-int-thick-7-2518944.pdf?src-supplier=Digi-Key; ComponentLink17Description: https://datasheet.ciiva.com/2518/pyu-r-int-thick-7-2518944.pdf?src-supplier=Digi-Key; ComponentLink18URL: https://datasheet.ciiva.com/2518/pyu-r-int-thick-7-2518945.pdf?src-supplier=Digi-Key; ComponentLink18Description: https://datasheet.ciiva.com/2518/pyu-r-int-thick-7-2518945.pdf?src-supplier=Digi-Key; ComponentLink19URL: https://datasheet.ciiva.com/7850/1018594-7850216.pdf?src-supplier=Element14; ComponentLink19Description: https://datasheet.ciiva.com/7850/1018594-7850216.pdf?src-supplier=Element14; ComponentLink20URL: https://datasheet.ciiva.com/7850/1018594-7850217.pdf?src-supplier=Element14; ComponentLink20Description: https://datasheet.ciiva.com/7850/1018594-7850217.pdf?src-supplier=Element14; ComponentLink21URL: https://datasheet.ciiva.com/2518/pyu-r-int-thick-7-2518943.pdf?src-supplier=Digi-Key; ComponentLink21Description: https://datasheet.ciiva.com/2518/pyu-r-int-thick-7-2518943.pdf?src-supplier=Digi-Key; ComponentLink22URL: https://datasheet.ciiva.com/12667/pyu-rc0402-51-rohs-l-6-r-12667914.pdf?src-supplier=Mouser; ComponentLink22Description: https://datasheet.ciiva.com/12667/pyu-rc0402-51-rohs-l-6-r-12667914.pdf?src-supplier=Mouser; Supplier 1: Digi-Key; Supplier Part Number 1: 311-470JRCT-ND; RoHS: Yes; Category: Chip SMD Resistors; Stock 1: 2315711; Pricing 1: 1=0,10000, 10=0,01300, 100=0,00530, 1000=0,00236, 2500=0,00205, 5000=0,00169 (USD); Case/Package: 0402; Case Code (Metric): 1005; Case Code (Imperial): 0402; Min Operating Temperature: -55°C; Max Operating Temperature: 155°C; Tolerance: 5%; Packaging: Tape and Reel; Package Quantity: 1; Composition: Thick Film; Number of Terminations: 2; Termination: SMD/SMT; Military Standard: Not; Working Voltage: 50V; Features: Moisture Resistant; Length: 1mm; Height: 0.016inch; Width: 0.02inch; Depth: 0.5mm; REACH SVHC: Unknown; Lead Free: Lead Free
R42 = RES_1K_0603: Manufacturer: Yageo; ManufacturerPartNumber: AC0603JR-071KL; DetailedDesctiprition: 1 kOhms ±5% 0.1W, 1/10W Chip Resistor 0603 (1608 Metric) Automotive AEC-Q200, Moisture Resistant Thick Film; DigikeyPartNumber: YAG3646CT-ND
R44 = Res3: RES SMD 5.49K OHM 1% 1/16W 0402; MPN: RC0402FR-073K74L; ComponentLink1URL: https://datasheet.ciiva.com/11819/0900766b80c66297-11819477.pdf?src-supplier=RSComponents; ComponentLink1Description: https://datasheet.ciiva.com/11819/0900766b80c66297-11819477.pdf?src-supplier=RSComponents; ComponentLink2URL: https://datasheet.ciiva.com/12666/pyu-rc0402-51-rohs-l-6-r-12666741.pdf?src-supplier=Mouser; ComponentLink2Description: https://datasheet.ciiva.com/12666/pyu-rc0402-51-rohs-l-6-r-12666741.pdf?src-supplier=Mouser; ComponentLink3URL: https://datasheet.ciiva.com/17063/pyu-rc0402-51-rohs-l-6-r-17063193.pdf?src-supplier=Future+Electronics; ComponentLink3Description: https://datasheet.ciiva.com/17063/pyu-rc0402-51-rohs-l-6-r-17063193.pdf?src-supplier=Future+Electronics; ComponentLink4URL: https://datasheet.ciiva.com/22747/1018594-22747513.pdf?src-supplier=Element14; ComponentLink4Description: https://datasheet.ciiva.com/22747/1018594-22747513.pdf?src-supplier=Element14; ComponentLink5URL: https://datasheet.ciiva.com/7849/1018594-7849869.pdf?src-supplier=Element14; ComponentLink5Description: https://datasheet.ciiva.com/7849/1018594-7849869.pdf?src-supplier=Element14; ComponentLink6URL: https://datasheet.ciiva.com/7983/1018594-7983502.pdf?src-supplier=Element14; ComponentLink6Description: https://datasheet.ciiva.com/7983/1018594-7983502.pdf?src-supplier=Element14; ComponentLink7URL: https://datasheet.ciiva.com/7849/1018594-7849871.pdf?src-supplier=Element14; ComponentLink7Description: https://datasheet.ciiva.com/7849/1018594-7849871.pdf?src-supplier=Element14; ComponentLink8URL: https://datasheet.ciiva.com/2553/pyu-r-int-thick-7-2553200.pdf?src-supplier=Digi-Key; ComponentLink8Description: https://datasheet.ciiva.com/2553/pyu-r-int-thick-7-2553200.pdf?src-supplier=Digi-Key; ComponentLink9URL: https://datasheet.ciiva.com/7983/1018594-7983501.pdf?src-supplier=Element14; ComponentLink9Description: https://datasheet.ciiva.com/7983/1018594-7983501.pdf?src-supplier=Element14; ComponentLink10URL: https://datasheet.ciiva.com/2553/pyu-r-int-thick-7-2553201.pdf?src-supplier=Digi-Key; ComponentLink10Description: https://datasheet.ciiva.com/2553/pyu-r-int-thick-7-2553201.pdf?src-supplier=Digi-Key; ComponentLink11URL: https://datasheet.ciiva.com/2553/pyu-r-int-thick-7-2553202.pdf?src-supplier=Digi-Key; ComponentLink11Description: https://datasheet.ciiva.com/2553/pyu-r-int-thick-7-2553202.pdf?src-supplier=Digi-Key; ComponentLink12URL: https://datasheet.ciiva.com/15189/getdatasheetpartid-251817-15189388.pdf?src-supplier=Verical; ComponentLink12Description: https://datasheet.ciiva.com/15189/getdatasheetpartid-251817-15189388.pdf?src-supplier=Verical; ComponentLink13URL: https://datasheet.ciiva.com/11808/0900766b80c66297-11808454.pdf?src-supplier=RSComponents; ComponentLink13Description: https://datasheet.ciiva.com/11808/0900766b80c66297-11808454.pdf?src-supplier=RSComponents; ComponentLink14URL: https://datasheet.ciiva.com/2453/pyu-r-int-thick-7-2453494.pdf?src-supplier=Digi-Key; ComponentLink14Description: https://datasheet.ciiva.com/2453/pyu-r-int-thick-7-2453494.pdf?src-supplier=Digi-Key; ComponentLink15URL: https://datasheet.ciiva.com/2453/pyu-r-int-thick-7-2453495.pdf?src-supplier=Digi-Key; ComponentLink15Description: https://datasheet.ciiva.com/2453/pyu-r-int-thick-7-2453495.pdf?src-supplier=Digi-Key; ComponentLink16URL: https://datasheet.ciiva.com/7983/1018594-7983511.pdf?src-supplier=Element14; ComponentLink16Description: https://datasheet.ciiva.com/7983/1018594-7983511.pdf?src-supplier=Element14; ComponentLink17URL: https://datasheet.ciiva.com/12558/pyu-rc0402-51-rohs-l-6-r-8721-12558796.pdf?src-supplier=Mouser; ComponentLink17Description: https://datasheet.ciiva.com/12558/pyu-rc0402-51-rohs-l-6-r-8721-12558796.pdf?src-supplier=Mouser; ComponentLink18URL: https://datasheet.ciiva.com/2453/pyu-r-int-thick-7-2453493.pdf?src-supplier=Digi-Key; ComponentLink18Description: https://datasheet.ciiva.com/2453/pyu-r-int-thick-7-2453493.pdf?src-supplier=Digi-Key; ComponentLink19URL: https://datasheet.ciiva.com/46394/1018594-46394974.pdf?src-supplier=Element14; ComponentLink19Description: https://datasheet.ciiva.com/46394/1018594-46394974.pdf?src-supplier=Element14; ComponentLink20URL: https://datasheet.ciiva.com/15189/getdatasheetpartid-323692-15189807.pdf?src-supplier=Verical; ComponentLink20Description: https://datasheet.ciiva.com/15189/getdatasheetpartid-323692-15189807.pdf?src-supplier=Verical; ComponentLink21URL: https://datasheet.ciiva.com/2519/pyu-r-int-thick-7-2519204.pdf?src-supplier=Digi-Key; ComponentLink21Description: https://datasheet.ciiva.com/2519/pyu-r-int-thick-7-2519204.pdf?src-supplier=Digi-Key; ComponentLink22URL: https://datasheet.ciiva.com/2519/pyu-r-int-thick-7-2519205.pdf?src-supplier=Digi-Key; ComponentLink22Description: https://datasheet.ciiva.com/2519/pyu-r-int-thick-7-2519205.pdf?src-supplier=Digi-Key; ComponentLink23URL: https://datasheet.ciiva.com/2519/pyu-r-int-thick-7-2519206.pdf?src-supplier=Digi-Key; ComponentLink23Description: https://datasheet.ciiva.com/2519/pyu-r-int-thick-7-2519206.pdf?src-supplier=Digi-Key; ComponentLink24URL: https://datasheet.ciiva.com/5556/rk73h-5556598.pdf?src-supplier=Mouser; ComponentLink24Description: https://datasheet.ciiva.com/5556/rk73h-5556598.pdf?src-supplier=Mouser; ComponentLink25URL: https://datasheet.ciiva.com/16868/pyu-rc0402-51-rohs-l-6-16868119.pdf?src-supplier=Avnet+Europe; ComponentLink25Description: https://datasheet.ciiva.com/16868/pyu-rc0402-51-rohs-l-6-16868119.pdf?src-supplier=Avnet+Europe; ComponentLink26URL: https://datasheet.ciiva.com/8892/pyu-rc0402-51-rohs-l-6-8892634.pdf?src-supplier=Avnet; ComponentLink26Description: https://datasheet.ciiva.com/8892/pyu-rc0402-51-rohs-l-6-8892634.pdf?src-supplier=Avnet; ComponentLink27URL: https://datasheet.ciiva.com/28409/pyu-rc0402-51-rohs-l-6-28409292.pdf?src-supplier=Avnet+Europe; ComponentLink27Description: https://datasheet.ciiva.com/28409/pyu-rc0402-51-rohs-l-6-28409292.pdf?src-supplier=Avnet+Europe; ComponentLink28URL: https://datasheet.ciiva.com/2453/pyu-r-int-thick-7-2453629.pdf?src-supplier=Digi-Key; ComponentLink28Description: https://datasheet.ciiva.com/2453/pyu-r-int-thick-7-2453629.pdf?src-supplier=Digi-Key; ComponentLink29URL: https://datasheet.ciiva.com/2453/pyu-r-int-thick-7-2453630.pdf?src-supplier=Digi-Key; ComponentLink29Description: https://datasheet.ciiva.com/2453/pyu-r-int-thick-7-2453630.pdf?src-supplier=Digi-Key